# EAGLE design Main-board (EAGLE 9.6.2)
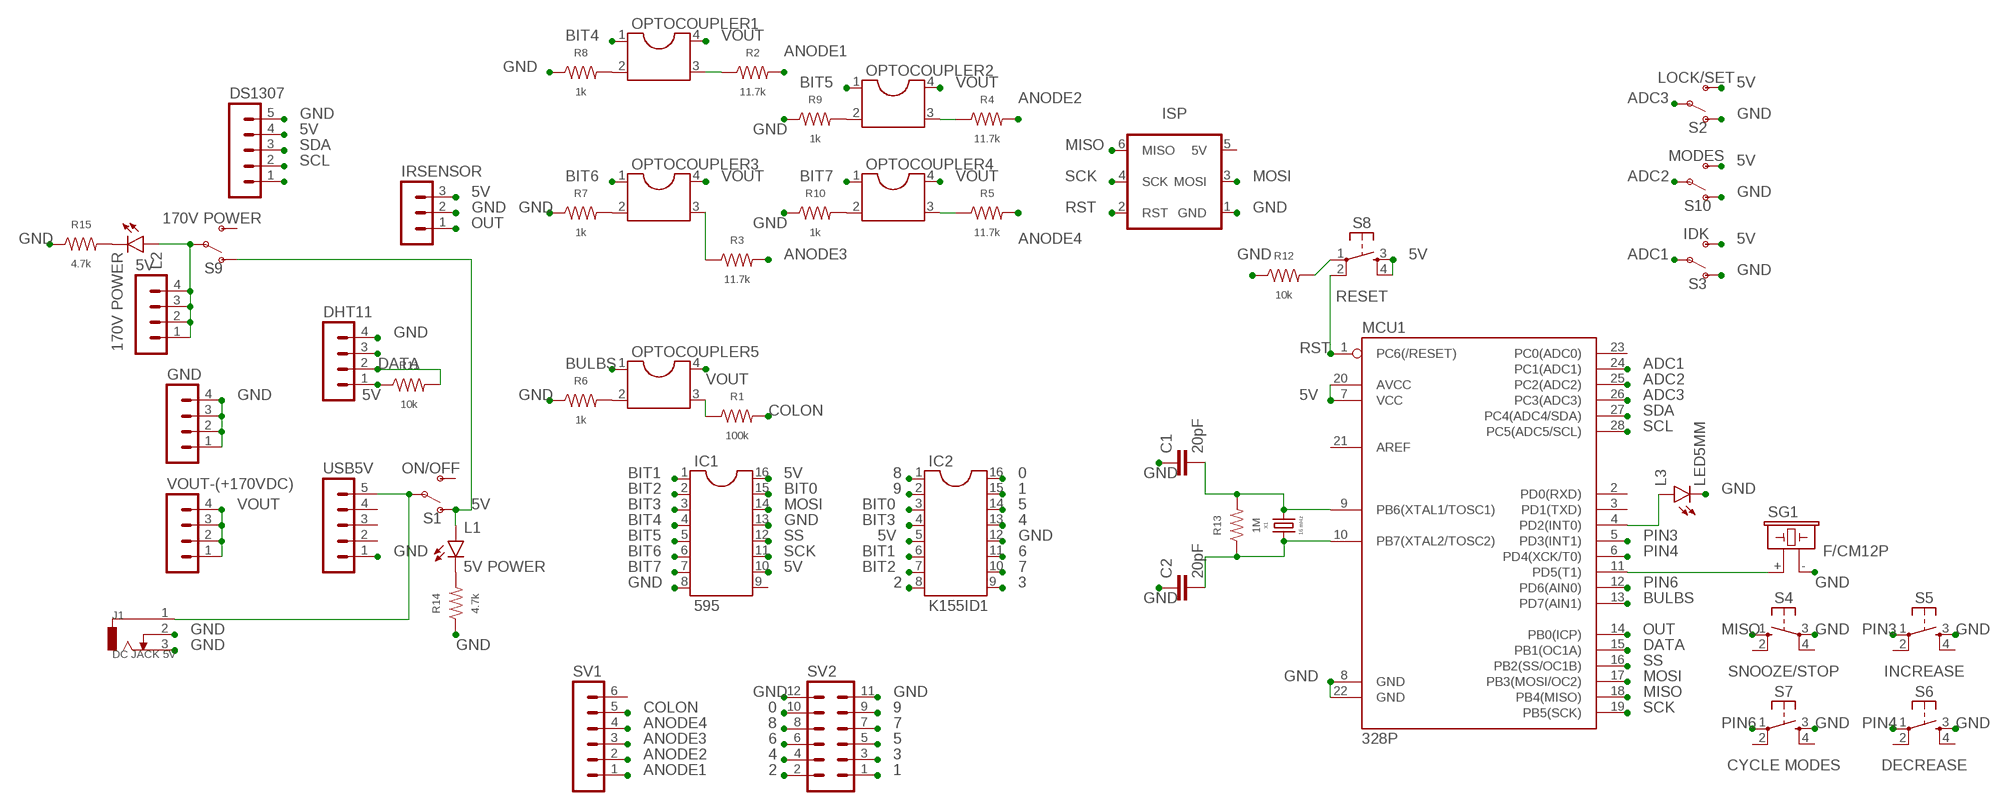
[diagram p0: schematic, sheet 1]

## Parts
5V  MA04-1  [MA04-1]
C1  20pF  CAP_DISK  [CAP-PTH-2.54]
C2  20pF  CAP_DISK  [CAP-PTH-2.54]
DHT11  MA04-1  [MA04-1]
DS1307  MA05-1  [MA05-1]
GND  MA04-1  [MA04-1]
H1  ISP_HEADER  [ICSP]
IC1  595  DIL16  [DIL16]
IC2  K155ID1  DIL16  [DIL16]
IRSENSOR  MA03-1  [MA03-1]
J1  DC JACK 5V  DC_JACK/PJ-202AH  [PJ-202AH]
L1  5V POWER  LED3MM  [LED3MM]
L2  170V POWER  LED3MM  [LED3MM]
L3  LED5MM  [LED5MM]
MCU1  328P  ATMEGA328P_PDIP  [DIP28]
OPTOCOUPLER1  DIL4  [DIL04]
OPTOCOUPLER2  DIL4  [DIL04]
OPTOCOUPLER3  DIL4  [DIL04]
OPTOCOUPLER4  DIL4  [DIL04]
OPTOCOUPLER5  DIL4  [DIL04]
R1  100k  RESISTOR  [0207/10]
R2  11.7k  RESISTOR  [0207/10]
R3  11.7k  RESISTOR  [0207/10]
R4  11.7k  RESISTOR  [0207/10]
R5  11.7k  RESISTOR  [0207/10]
R6  1k  RESISTOR  [0207/10]
R7  1k  RESISTOR  [0207/10]
R8  1k  RESISTOR  [0207/10]
R9  1k  RESISTOR  [0207/10]
R10  1k  RESISTOR  [0207/10]
R11  10k  RESISTOR  [0207/10]
R12  10k  RESISTOR  [0207/10]
R13  1M  RESISTOR  [0207/10]
R14  4.7k  RESISTOR  [0207/10]
R15  4.7k  RESISTOR  [0207/10]
S1  ON/OFF  SLIDE_SWITCHEG1218  [EG1218]
S2  LOCK/SET  SLIDE_SWITCHEG1218  [EG1218]
S3  IDK  SLIDE_SWITCHEG1218  [EG1218]
S4  SNOOZE/STOP  MOMENTARY_BUTTONS-ROUND  [B3F-40XX-ROUND]
S5  INCREASE  MOMENTARY_BUTTONS6MMSMALL  [TACTILE_SWITCH_PTH_6.0MM]
S6  DECREASE  MOMENTARY_BUTTONS6MMSMALL  [TACTILE_SWITCH_PTH_6.0MM]
S7  CYCLE MODES  MOMENTARY_BUTTONS6MMSMALL  [TACTILE_SWITCH_PTH_6.0MM]
S8  RESET  MOMENTARY_BUTTONS6MMSMALL  [TACTILE_SWITCH_PTH_6.0MM]
S9  170V POWER  SLIDE_SWITCHEG1218  [EG1218]
S10  MODES  SLIDE_SWITCHEG1218  [EG1218]
SG1  F/CM12P  [F/CM12P]
SV1  MA06-1  [MA06-1]
SV2  MA06-2  [MA06-2]
USB5V  MA05-1  [MA05-1]
VOUT-(+170VDC)  MA04-1  [MA04-1]
X1  16 mHz  CRYSTAL_16MHZ  [HC49US]

## Nets
0: IC2.16 SV2.10
1: IC2.15 SV2.1
2: IC2.8 SV2.2
3: IC2.9 SV2.3
4: IC2.13 SV2.4
5: IC2.14 SV2.5
5V: DHT11.1 DS1307.4 IC1.10 IC1.16 IC2.5 IRSENSOR.3 L1.A MCU1.7(VCC) MCU1.20(AVCC) R11.1 S1.O S2.S S3.S S8.3(S) S8.4(S1) S9.O S10.S
6: IC2.11 SV2.6
7: IC2.10 SV2.7
8: IC2.1 SV2.8
9: IC2.2 SV2.9
ADC1: MCU1.24(PC1(ADC1)) S3.P
ADC2: MCU1.25(PC2(ADC2)) S10.P
ADC3: MCU1.26(PC3(ADC3)) S2.P
ANODE1: R2.2 SV1.1
ANODE2: R4.2 SV1.2
ANODE3: R3.2 SV1.3
ANODE4: R5.2 SV1.4
BIT0: IC1.15 IC2.3
BIT1: IC1.1 IC2.6
BIT2: IC1.2 IC2.7
BIT3: IC1.3 IC2.4
BIT4: IC1.4 OPTOCOUPLER1.1
BIT5: IC1.5 OPTOCOUPLER2.1
BIT6: IC1.6 OPTOCOUPLER3.1
BIT7: IC1.7 OPTOCOUPLER4.1
BULBS: MCU1.13(PD7(AIN1)) OPTOCOUPLER5.1
COLON: R1.2 SV1.5
DATA: DHT11.2 MCU1.15(PB1(OC1A)) R11.2
GND: C1.1 C2.1 DHT11.4 DS1307.5 GND.1 GND.2 GND.3 GND.4 H1.1(GND) IC1.8 IC1.13 IC2.12 IRSENSOR.2 J1.2 J1.3 L3.K(C) MCU1.8(GND) MCU1.22(GND) R6.1 R7.1 R8.1 R9.1 R10.1 R12.1 R14.1 R15.1 S2.O S3.O S4.3(P) S5.3(S) S6.3(S) S7.3(S) S10.O SG1.- SV2.11 SV2.12 USB5V.1
MISO: H1.6(MISO) MCU1.18(PB4(MISO)) S4.1(S)
MOSI: H1.3(MOSI) IC1.14 MCU1.17(PB3(MOSI/OC2))
N$1: OPTOCOUPLER3.3 R3.1
N$2: L1.K(C) R14.2
N$3: OPTOCOUPLER1.3 R2.1
N$4: OPTOCOUPLER2.3 R4.1
N$5: OPTOCOUPLER5.2 R6.2
N$6: OPTOCOUPLER3.2 R7.2
N$7: OPTOCOUPLER1.2 R8.2
N$8: OPTOCOUPLER2.2 R9.2
N$9: OPTOCOUPLER4.2 R10.2
N$10: OPTOCOUPLER4.3 R5.1
N$11: L2.K(C) R15.2
N$12: R12.2 S8.1(P)
N$13: OPTOCOUPLER5.3 R1.1
N$14: C1.2 MCU1.9(PB6(XTAL1/TOSC1)) R13.2 X1.2
N$15: C2.2 MCU1.10(PB7(XTAL2/TOSC2)) R13.1 X1.1
N$18: DHT11.3
N$22: 5V.1 5V.2 5V.3 5V.4 L2.A S9.P
N$25: J1.1 S1.P USB5V.5
N$26: L3.A MCU1.4(PD2(INT0))
N$32: DS1307.1
N$33: MCU1.11(PD5(T1)) SG1.+
OUT: IRSENSOR.1 MCU1.14(PB0(ICP))
PIN3: MCU1.5(PD3(INT1)) S5.1(P)
PIN4: MCU1.6(PD4(XCK/T0)) S6.1(P)
PIN6: MCU1.12(PD6(AIN0)) S7.1(P)
RST: H1.2(RST) MCU1.1(PC6(/RESET)) S8.2(P1)
SCK: H1.4(SCK) IC1.11 MCU1.19(PB5(SCK))
SCL: DS1307.2 MCU1.28(PC5(ADC5/SCL))
SDA: DS1307.3 MCU1.27(PC4(ADC4/SDA))
SS: IC1.12 MCU1.16(PB2(SS/OC1B))
VOUT: OPTOCOUPLER1.4 OPTOCOUPLER2.4 OPTOCOUPLER3.4 OPTOCOUPLER4.4 OPTOCOUPLER5.4 VOUT-(+170VDC).1 VOUT-(+170VDC).2 VOUT-(+170VDC).3 VOUT-(+170VDC).4
Unconnected: IC1.9 MCU1.2(PD0(RXD)) MCU1.3(PD1(TXD)) MCU1.21(AREF) MCU1.23(PC0(ADC0)) S1.S S4.2(S1) S4.4(P1) S5.2(P1) S5.4(S1) S6.2(P1) S6.4(S1) S7.2(P1) S7.4(S1) S9.S SV1.6 USB5V.2 USB5V.3 USB5V.4

## Power pins joined to a net without a drawn wire
5V: H1.5(5V)

## Library data of the parts
5V DHT11 GND VOUT-(+170VDC) = con-lstb:MA04-1: PIN HEADER; OC_FARNELL: unknown; OC_NEWARK: unknown
C1 C2 = ACES_THT:CAP_DISK: Use for 0.1μF (103) and 0.01μF (104). Also suitable for 22ρF crystal filter caps for offboard ATmega328p.
DS1307 USB5V = con-lstb:MA05-1: PIN HEADER; OC_FARNELL: unknown; OC_NEWARK: unknown
H1 = ACES_THT:ISP_HEADER: No more excuses for getting these lines crossed!
IC1 IC2 = ic-package:DIL16: Dual In Line / Socket
IRSENSOR = con-lstb:MA03-1: PIN HEADER; OC_FARNELL: unknown; OC_NEWARK: unknown
J1 = ACES_THT:DC_JACK: Through hole pins are either tapered pins (PJ-102A) or eyelet (straight or kinked) PJ-202AH.
L1-L3 = ACES_THT:LED
MCU1 = ACES_THT:ATMEGA328P_PDIP: Atmel 328P Through hole ATMEGA328P uC used in the Arduino: 32kb flash, 1k EEPROM, 2k SRAM Datasheet <http://www.sparkfun.com/datasheets/Components/SMD/ATMega328.pdf> Use together with either the CRYSTAL_16MHz or RESONATOR in this library.; PROD_ID: IC-09136
OPTOCOUPLER1-OPTOCOUPLER5 = ic-package:DIL4: Dual In Line / Socket
R1-R15 = ACES_THT:RESISTOR: Based on rcl Libray part R-US_0207/10 with longer oval pads for easier hand soldering. Digikey Part #: 470QBK-ND <https://www.digikey.ca/products/en/resistors/through-hole-resistors/53?k=fixed+resistor&k=&pkeyword=fixed+resistor&sv=1&pv2=4&pv174=18&sf=0&FV=ffe00035%2Cfffc000d%2C1c0003%2C1f140000%2Cmu470+Ohms%7C2085&quantity=&ColumnSort=0&page=1&stock=1&pageSize=25>
S1-S3 S9 S10 = ACES_THT:SLIDE_SWITCH
S4-S8 = ACES_THT:MOMENTARY_BUTTONS: OMRON SWITCH
SG1 = buzzer:F/CM12P: BUZZER Source: Buerklin; OC_FARNELL: unknown; OC_NEWARK: unknown
SV1 = con-lstb:MA06-1: PIN HEADER; OC_FARNELL: unknown; OC_NEWARK: unknown
SV2 = con-lstb:MA06-2: PIN HEADER; OC_FARNELL: unknown; OC_NEWARK: unknown
X1 = ACES_THT:CRYSTAL_16MHZ

## Board
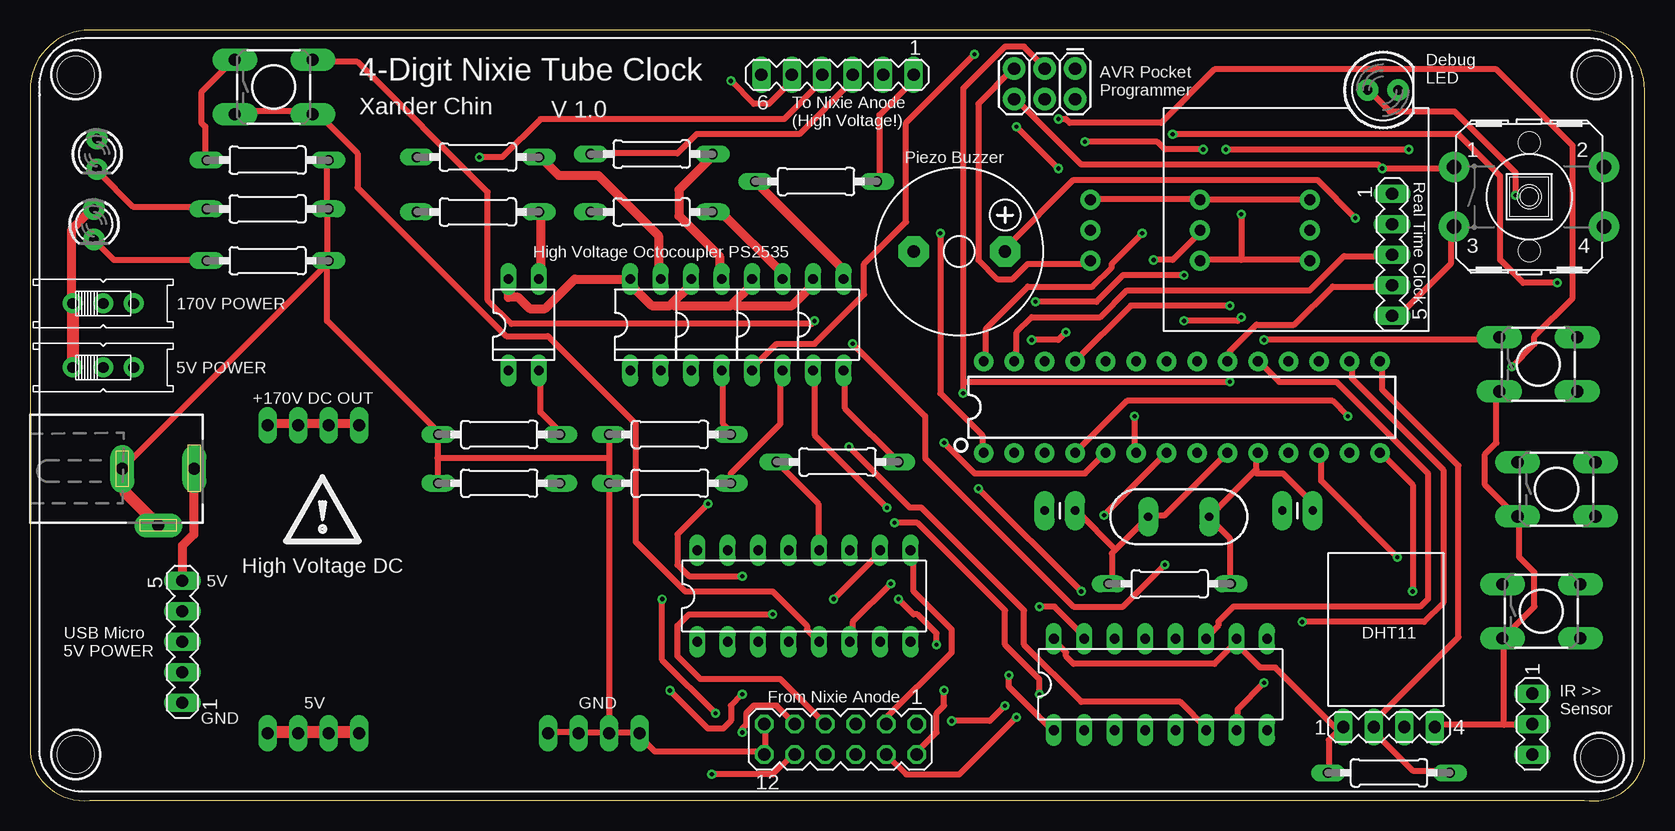
[diagram p1: board, top side]
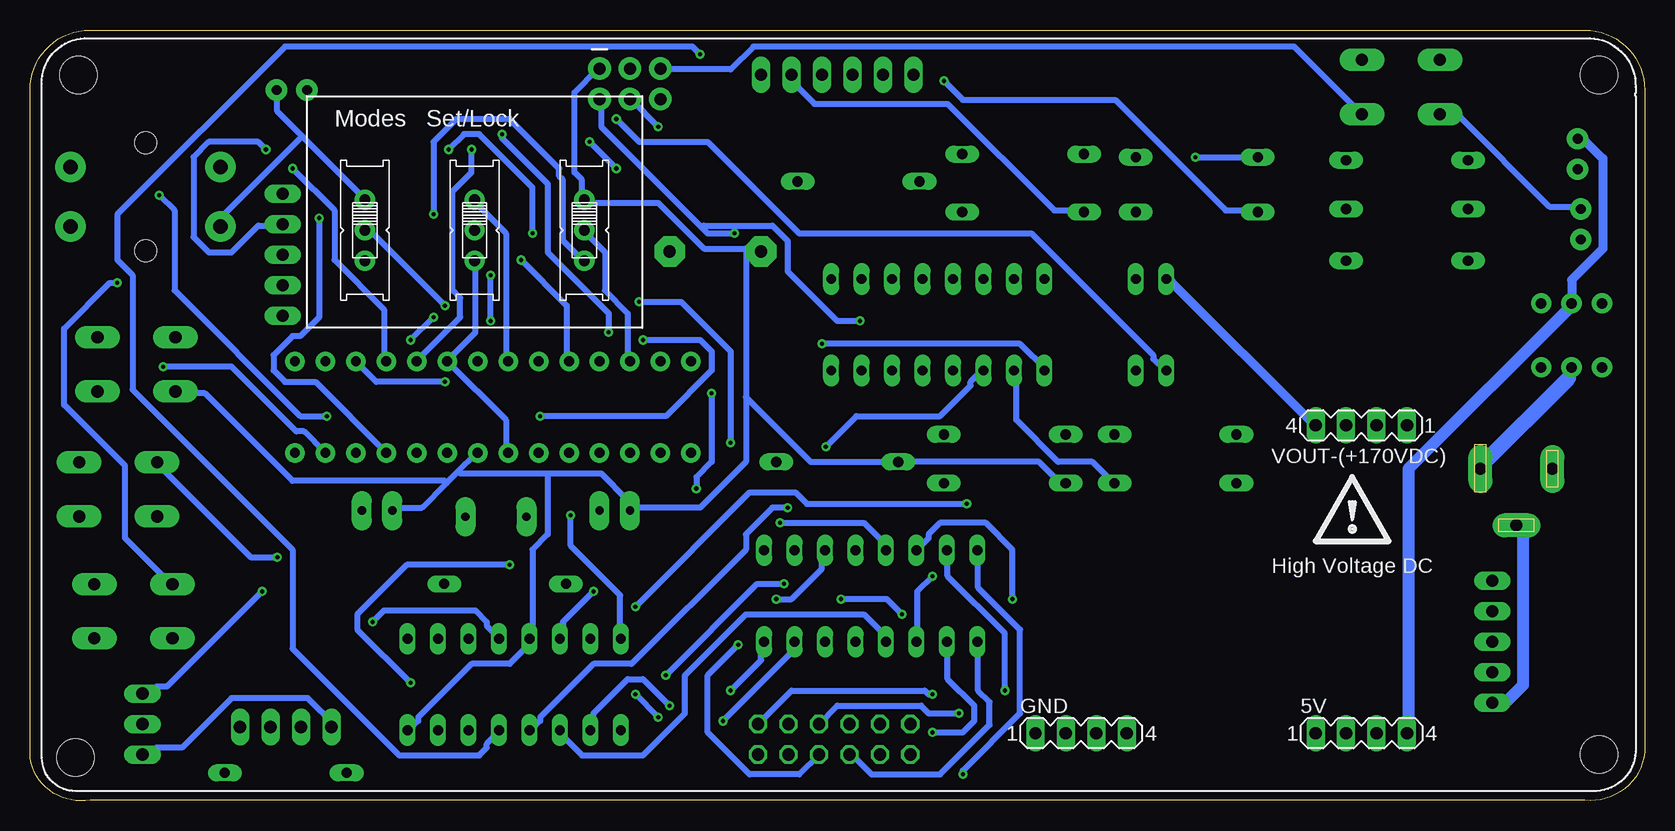
[diagram p2: board, bottom side, seen from below]

Size 134.6 x 64.24 mm. Coordinates in mm from the lower left corner, seen from the top.
Outline: 134.6,3.55 134.6,59.24 arc90 129.6,64.24 5,64.24 arc90 0,59.24 0,4.04 arc90 4.98,0.06 129.58,0.07 arc90 134.6,3.55
Copper layers (1*16): Top 0.035mm / dielectric 1.5mm / Bottom 0.035mm
Design rules "ACES_THT *": minimum track width 20mil, minimum drill 0.35mm, track to track 20mil, track to pad 20mil, pad to pad 20mil, via to via 20mil, smd to smd 6mil, copper to edge 40mil, drill to drill 6mil, minimum pad ring 10mil, minimum via ring 8mil, stop-mask expansion 4mil, vias tented up to drill 0mil, thermal gap 10mil

### Footprints (pad centres in the part's own frame; a part is rotated, then mirrored left to right if it is on the bottom)
MA04-1 = drill 1.016 long: 1 -3.81,0; 2 -1.27,0; 3 1.27,0; 4 3.81,0
CAP-PTH-2.54 = drill 0.7 pad 1.651 long: 1 -1.27,0; 2 1.27,0
MA05-1 = drill 1.016 long: 1 -5.08,0; 2 -2.54,0; 3 0,0; 4 2.54,0; 5 5.08,0
ICSP = drill 1.016 pad 1.88: 1 0,0; 2 0,2.54; 3 2.54,0; 4 2.54,2.54; 5 5.08,0; 6 5.08,2.54
DIL16 = drill 0.813 long: 1 -8.89,-3.81; 2 -6.35,-3.81; 3 -3.81,-3.81; 4 -1.27,-3.81; 5 1.27,-3.81; 6 3.81,-3.81; 7 6.35,-3.81; 8 8.89,-3.81; 9 8.89,3.81; 10 6.35,3.81; 11 3.81,3.81; 12 1.27,3.81; 13 -1.27,3.81; 14 -3.81,3.81; 15 -6.35,3.81; 16 -8.89,3.81
MA03-1 = drill 1.016 long: 1 -2.54,0; 2 0,0; 3 2.54,0
PJ-202AH = drill 1 pad 2 long: 1 13.7,4.5; 2 10.7,-0.2; 3 7.7,4.5
LED3MM = drill 0.813 pad 1.778: A 0,1.27; K 0,-1.27
LED5MM = drill 0.813 pad 1.778: A 0,1.27; K 0,-1.27
DIP28 = drill 0.813 pad 1.626: 1 -16.51,-3.81; 2 -13.97,-3.81; 3 -11.43,-3.81; 4 -8.89,-3.81; 5 -6.35,-3.81; 6 -3.81,-3.81; 7 -1.27,-3.81; 8 1.27,-3.81; 9 3.81,-3.81; 10 6.35,-3.81; 11 8.89,-3.81; 12 11.43,-3.81; 13 13.97,-3.81; 14 16.51,-3.81; 15 16.51,3.81; 16 13.97,3.81; 17 11.43,3.81; 18 8.89,3.81; 19 6.35,3.81; 20 3.81,3.81; 21 1.27,3.81; 22 -1.27,3.81; 23 -3.81,3.81; 24 -6.35,3.81; 25 -8.89,3.81; 26 -11.43,3.81; 27 -13.97,3.81; 28 -16.51,3.81
DIL04 = drill 0.813 long: 1 -1.27,-3.81; 2 1.27,-3.81; 3 1.27,3.81; 4 -1.27,3.81
0207/10 = drill 0.85 pad 1.422 long: 1 -5.08,0; 2 5.08,0
EG1218 = drill 0.9 pad 1.676: O -2.54,0; P 0,0; S 2.54,0
B3F-40XX-ROUND = drill 1.194 pad 2.54: 1 -6.248,2.489; 2 6.248,2.489; 3 -6.248,-2.489; 4 6.248,-2.489 | hole 1.803: 0,-4.496; 0,4.496
TACTILE_SWITCH_PTH_6.0MM = drill 1.016 pad 1.88 long: 1 -3.251,2.261; 2 3.251,2.261; 3 -3.251,-2.261; 4 3.251,-2.261
F/CM12P = drill 1.016 pad 2.54 octagon: + 3.81,0; - -3.81,0
MA06-1 = drill 1.016 long: 1 -6.35,0; 2 -3.81,0; 3 -1.27,0; 4 1.27,0; 5 3.81,0; 6 6.35,0
MA06-2 = drill 1.016 octagon: 1 -6.35,-1.27; 2 -6.35,1.27; 3 -3.81,-1.27; 4 -3.81,1.27; 5 -1.27,-1.27; 6 -1.27,1.27; 7 1.27,-1.27; 8 1.27,1.27; 9 3.81,-1.27; 10 3.81,1.27; 11 6.35,-1.27; 12 6.35,1.27
MOUNTINGHOLE_3.2MM_PLATEDTHIN = hole 3.1: 0,0
HC49US = drill 0.7 pad 1.651 long: 1 -2.54,0; 2 2.54,0

### Placement (x,y rotation side)
5V  23.62,5.64 0 bottom
C1  85.85,24.19 0 top
C2  105.66,24.19 0 top
DHT11  113.28,6.15 0 top
DS1307  113.54,45.52 270 top
GND  46.99,5.64 0 bottom
H1  87.12,61.02 180 top
IC1  94.23,9.71 0 top
IC2  64.52,17.07 0 top
IRSENSOR  125.22,6.41 270 top
J1  0,23.17 0 top
L1  5.33,48.06 0 top
L2  5.59,53.9 0 top
L3  112.78,59.24 90 top
MCU1  96.01,32.82 0 top
OPTOCOUPLER1  66.55,39.68 0 top
OPTOCOUPLER2  61.47,39.68 0 top
OPTOCOUPLER3  56.39,39.68 0 top
OPTOCOUPLER4  51.31,39.68 0 top
OPTOCOUPLER5  41.15,39.68 0 top
R1  37.34,49.08 180 top
R2  65.53,51.62 0 top
R3  51.82,53.9 180 top
R4  51.82,49.08 180 top
R5  37.34,53.65 180 top
R6  39.12,30.54 0 top
R7  53.34,30.54 0 top
R8  67.31,28.25 0 top
R9  53.34,26.47 0 top
R10  39.12,26.47 0 top
R11  113.28,2.34 0 top
R12  19.81,53.4 180 top
R13  95,18.09 180 top
R14  19.81,45.01 180 top
R15  19.81,49.33 180 top
S1  6.1,36.12 0 top
S2  88.39,47.55 270 bottom
S3  97.54,47.55 270 bottom
S4  124.97,50.35 0 top
S5  125.73,36.38 0 top
S6  125.98,15.8 0 top
S7  127.25,25.96 0 top
S8  20.32,59.49 0 top
S9  6.1,41.46 0 top
S10  106.68,47.55 270 bottom
SG1  77.47,45.78 0 top
SV1  67.31,60.51 180 top
SV2  67.56,5.14 180 top
U$1  [MOUNTINGHOLE_3.2MM_PLATEDTHIN]  3.81,60.51 0 top
U$2  [MOUNTINGHOLE_3.2MM_PLATEDTHIN]  3.81,3.87 0 top
U$3  [MOUNTINGHOLE_3.2MM_PLATEDTHIN]  130.81,3.61 0 top
U$4  [MOUNTINGHOLE_3.2MM_PLATEDTHIN]  130.56,60.51 0 top
U$5  [CAUTION-HIGH-VOLTAGE]  21.84,21.9 0 top
U$6  [CAUTION-HIGH-VOLTAGE]  26.92,21.9 0 bottom
USB5V  12.7,13.26 90 top
VOUT-(+170VDC)  23.62,31.3 180 bottom
X1  95.76,23.68 180 top

### Tracks (layer width: path | path; a pad name or v marks a point on that pad's centre or on a via)
0  (via drill 0.35)
  Top 0.508: v56.83,2.21 61.91,2.21 63.5,3.8 SV2.10
  Bottom 0.508: v56.83,2.21 56.83,2.53 52.07,7.29 52.07,14.28 55.56,17.77 55.56,20.63 IC2.16
1  (via drill 0.35)
  Top 0.508: v53.34,9.2 56.52,6.02 57.78,6.02 58.42,6.66 58.42,7.93 v59.37,8.88
  Bottom 0.508: v53.34,9.2 53.34,13.96 58.1,18.72 58.1,20.63 IC2.15 | v59.37,8.88 59.69,8.88 60.01,9.2 71.12,9.2 SV2.1
2  (via drill 0.35)
  Top 0.508: v76.2,9.2 76.2,7.93 75.56,7.29 75.56,5.71 73.98,4.12 SV2.2
  Bottom 0.508: v76.2,9.2 73.66,11.74 73.66,13.01 IC2.8
3
  Top 0.508: IC2.9 73.66,20.63 73.66,17.45 76.83,14.28 76.83,12.37 71.12,6.66 SV2.3
4  (via drill 0.35)
  Top 0.508: v72.07,23.17 73.98,23.17 81.28,15.87 81.28,13.01 84.14,10.15 v84.14,8.88 | v82.23,6.98 77.47,2.21 73.03,2.21 SV2.4
  Bottom 0.508: v72.07,23.17 65.09,23.17 63.5,21.58 63.5,20.95 IC2.13 | v82.23,6.98 v84.14,8.88
5  (via drill 0.35)
  Top 0.508: v52.7,16.82 52.7,11.74 v57.15,7.29
  Bottom 0.508: IC2.14 59.69,21.9 59.69,22.22 58.74,23.17 54.93,23.17 52.7,20.95 v52.7,16.82 | v57.15,7.29 59.69,7.29 60.33,7.93 67.31,7.93 SV2.5
5V  (via drill 0.35)
  Top 0.508: 100.97,45.08 106.68,45.08 S10.S | 100.97,45.08 97.79,45.08 S3.S | DS1307.4 113.35,42.85 108.58,42.85 105.41,39.68 102.23,39.68 100.01,37.46 100.01,36.82 MCU1.20 | IC1.16 85.41,13.33 86.36,12.37 86.36,12.06 87,11.42 98.74,11.42 100.65,13.33 IC1.10 100.65,13.01 102.55,11.1 103.82,11.1 108.9,6.02 DHT11.1 109.22,6.02 108.27,5.07 108.27,2.53 R11.1 | v89.53,23.8 MCU1.7 | S2.S 88.27,44.76 83.19,44.76 81.92,43.49 80.64,43.49 79.06,45.08 79.06,58.09 81.92,60.95 H1.5 | 5.08,49.2 L1.A | IC2.5 64.77,14.28 64.77,14.6 61.91,17.45 54.61,17.45 50.48,21.58 50.48,31.42 43.18,38.73 39.69,38.73 27.3,51.11 27.3,53.97 23.81,57.46 S8.4 23.5,57.46 17.14,57.46 S8.3 | v100.97,48.89 100.97,45.08
  Top 0.762: 5.08,49.2 3.49,47.62 3.49,41.9 3.56,41.84 S9.O
  Top 1.016: S9.O S1.O
  Bottom 0.508: MCU1.7 94.93,29.2 94.93,31.74 MCU1.20 99.69,36.82 97.47,39.04 97.47,44.76 S3.S | IRSENSOR.3 124.08,4.44 121.92,4.44 117.79,8.56 111.44,8.56 109.22,6.34 DHT11.1 | v89.53,23.8 89.53,21.26 85.41,17.14 85.41,13.64 IC1.16 | L1.A 5.4,49.52 7.94,49.52 15.56,57.14 16.83,57.14 S8.3 | H1.5 81.92,60.95 76.2,60.95 74.3,62.86 29.21,62.86 23.81,57.46 S8.4 | v100.97,48.89 100.97,54.92 99.06,56.82 94.61,56.82 90.49,52.7 90.49,52.06 90.17,51.74 90.17,46.66 88.58,45.08 S2.S
6  (via drill 0.35)
  Top 0.508: v72.39,16.82 73.66,15.55 73.98,15.55 75.56,13.96 v75.56,13.01
  Bottom 0.508: v72.39,16.82 71.12,16.82 68.58,19.36 68.58,20.63 IC2.11 | v75.56,13.01 78.11,10.47 78.11,5.71 74.61,2.21 70.48,2.21 SV2.6
7  (via drill 0.35)
  Top 0.508: v66.99,16.82 70.8,20.63 IC2.10 | v61.91,15.55 54.93,15.55 53.98,14.6 53.98,12.06 55.88,10.15 62.55,10.15 SV2.7
  Bottom 0.508: v66.99,16.82 63.18,16.82 v61.91,15.55
8
  Bottom 0.508: IC2.1 55.56,13.01 55.56,9.2 54.61,8.25 54.61,6.34 58.74,2.21 64.45,2.21 66.04,3.8 SV2.8
9  (via drill 0.35)
  Top 0.508: v59.37,5.71 59.37,6.02 59.69,6.34 59.69,7.29 60.33,7.93 62.23,7.93 SV2.9
  Bottom 0.508: v59.37,5.71 56.83,5.71 55.88,6.66 55.88,7.93 58.1,10.15 58.1,13.01 IC2.2
ADC1  (via drill 0.35)
  Top 0.508: v93.66,45.08 95.25,45.08 97.47,47.3 S3.P
  Bottom 0.508: v93.66,45.08 89.85,41.27 89.85,36.82 MCU1.24
ADC2  (via drill 0.35)
  Top 0.508: MCU1.25 91.76,41.27 v100.01,41.27
  Bottom 0.508: v100.01,41.27 106.05,47.3 106.68,47.3 S10.P
ADC3
  Bottom 0.508: MCU1.26 84.77,36.82 84.77,40.63 86.68,42.54 86.68,45.71 88.27,47.3 S2.P
ANODE1
  Top 0.508: SV1.1 73.66,60 70.8,57.14 70.8,51.74 R2.2
ANODE2
  Bottom 0.508: SV1.2 71.12,60 69.22,58.09 58.1,58.09 49.21,49.2 46.99,49.2 R4.2
ANODE3
  Top 0.508: SV1.3 68.58,60 64.14,55.55 55.56,55.55 53.98,53.97 46.99,53.97 R3.2
ANODE4  (via drill 0.35)
  Top 0.508: v37.47,53.65 39.37,53.65 42.55,56.82 62.87,56.82 66.04,60 SV1.4
  Bottom 0.508: v37.47,53.65 R5.2
BIT0  (via drill 0.35)
  Top 0.508: v59.37,18.72 54.93,18.72 53.98,19.68 53.98,22.22 v56.52,24.76 | v84.14,16.18 85.41,16.18 87.95,13.64 IC1.15
  Bottom 0.508: v59.37,18.72 60.64,17.45 60.64,13.33 IC2.3 | v56.52,24.76 69.85,24.76 70.8,25.71 74.61,25.71 v84.14,16.18
BIT1  (via drill 0.35)
  Top 0.508: v71.75,18.09 68.58,14.91 68.58,13.33 IC2.6 | v81.6,10.47 81.6,9.52 85.09,6.02 IC1.1
  Bottom 0.508: v71.75,18.09 73.98,18.09 v81.6,10.47
BIT2  (via drill 0.35)
  Top 0.508: v76.83,6.66 80.01,6.66 v81.28,7.93
  Bottom 0.508: v76.83,6.66 71.12,12.37 71.12,13.01 IC2.7 | v81.28,7.93 83.5,10.15 84.77,10.15 87.63,7.29 87.63,6.02 IC1.2
BIT3
  Bottom 0.508: IC2.4 63.5,13.33 63.5,13.96 65.09,15.55 74.93,15.55 80.01,10.47 80.01,7.29 83.5,3.8 88.58,3.8 90.49,5.71 IC1.3
BIT4  (via drill 0.35)
  Top 0.508: v71.44,24.44 65.41,30.47 65.41,35.87 OPTOCOUPLER1.1
  Bottom 0.508: v71.44,24.44 72.71,24.44 74.93,22.22 74.93,20.95 84.45,11.42 87.63,11.42 92.08,6.98 92.08,6.66 92.71,6.02 IC1.4
BIT5  (via drill 0.35)
  Top 0.508: v78.74,62.22 73.03,56.51 73.03,48.25 69.53,44.76 69.53,42.22 65.41,38.09 62.23,38.09 60.01,35.87 OPTOCOUPLER2.1
  Bottom 0.508: v78.74,62.22 79.38,62.86 113.35,62.86 127.32,48.89 127.32,45.08 126.05,43.81 126.05,34.28 112.71,20.95 112.71,12.69 103.82,3.8 97.16,3.8 96.52,4.44 96.52,4.75 95.57,5.71 IC1.5
BIT6  (via drill 0.35)
  Top 0.508: v68.26,29.52 73.34,24.44 74.3,24.44 82.87,15.87 82.87,13.01 87.63,8.25 95.89,8.25 98.11,6.02 IC1.6
  Bottom 0.508: v68.26,29.52 65.72,32.06 58.74,32.06 56.2,34.6 56.2,34.92 55.24,35.87 OPTOCOUPLER3.1
BIT7  (via drill 0.35)
  Top 0.508: v102.87,9.83 100.65,7.61 100.65,6.02 IC1.7 | v94.61,19.68 91.12,16.18 87,16.18 74.61,28.57 74.61,32.06 v68.58,38.09
  Bottom 0.508: v102.87,9.83 107.31,14.28 107.31,15.55 103.19,19.68 v94.61,19.68 | v68.58,38.09 52.07,38.09 49.85,35.87 OPTOCOUPLER4.1
BULBS  (via drill 0.35)
  Top 0.508: v85.72,56.82 86.36,56.82 86.68,56.51 94.3,56.51 98.74,60.95 122.24,60.95 128.59,54.6 128.59,41.9 125.41,38.73 125.41,38.09 v123.51,36.19
  Bottom 0.508: v85.72,56.82 83.82,54.92 78.11,54.92 70.48,47.3 51.12,47.3 40.96,37.14 40.96,36.82 40.01,35.87 OPTOCOUPLER5.1 | v123.51,36.19 117.79,36.19 112.39,30.79 111.76,30.79 MCU1.13
COLON  (via drill 0.35)
  Top 0.508: v58.42,60 60.33,58.09 61.59,58.09 63.5,60 SV1.5
  Bottom 0.508: v58.42,60 56.83,58.41 44.13,58.41 34.92,49.2 32.38,49.2 R1.2
DATA
  Top 0.508: R11.2 118.11,2.53 115.25,2.53 111.76,6.02 DHT11.2 111.76,6.34 119.06,13.64 119.06,27.93 112.71,34.28 112.71,36.5 MCU1.15
GND
  Top 0.508: 7.94,27.61 J1.3 7.94,27.93 24.77,44.76 | 10.48,23.17 J1.2 | SV2.11 61.28,6.34 61.28,4.12 SV2.12 60.96,4.12 52.07,4.12 50.8,5.39 GND.1 50.8,5.71 48.26,5.71 | 45.72,5.71 43.18,5.71 GND.4 | 45.72,5.71 48.26,5.71 | 45.72,5.71 GND.3 | R8.1 65.72,24.76 65.72,20.95 IC2.12 | R12.1 24.77,53.33 24.77,49.52 R15.1 24.77,49.2 24.77,45.08 R14.1 24.93,44.93 24.77,44.76 | 33.97,28.57 33.97,30.47 R6.1 33.97,30.79 24.77,40 24.77,44.76 | 33.97,28.57 33.97,26.66 R10.1 | R7.1 48.26,28.57 | 48.26,28.57 R9.1 48.26,5.71 | 48.26,28.57 33.97,28.57 | 48.26,5.71 GND.2 | 122.87,6.34 124.78,6.34 124.9,6.41 IRSENSOR.2 | 122.87,6.34 117.16,6.34 DHT11.4 | 122.87,6.34 122.87,13.33 S6.3 122.87,13.64 125.41,16.18 125.41,19.04 124.14,20.31 124.14,23.49 S7.3 123.83,23.8 121.28,26.34 121.28,28.88 122.24,29.84 122.24,33.96 S5.3 | DS1307.5 113.67,40.63 114.3,40.63 118.43,44.76 118.43,47.62 S4.3 | S2.O 88.58,50.16 97.47,50.16 S3.O 97.79,50.16 106.68,50.16 S10.O
  Top 0.762: 7.94,25.71 7.94,27.61
  Top 1.016: 10.48,23.17 7.94,25.71
  Bottom 0.508: 10.16,22.53 10.48,22.85 J1.2 | 12.7,8.25 USB5V.1 | R9.1 48.26,26.66 48.9,26.66 50.48,28.25 R8.1 69.53,28.25 74.93,33.65 | IC1.8 102.87,6.02 102.23,6.66 102.23,6.98 97.79,11.42 94.61,11.42 92.71,13.33 IC1.13 92.71,13.64 92.71,20.95 91.44,22.22 91.44,27.3 | 99.85,26.5 101.92,24.44 104.14,24.44 C2.1 | 99.85,26.5 98.9,27.46 | 98.9,27.46 97.47,28.88 MCU1.8 | 91.44,27.3 98.74,27.3 98.9,27.46 | 91.44,27.3 87,27.3 84.77,25.07 84.77,24.44 C1.1 84.45,24.44 78.74,24.44 74.93,28.25 74.93,33.65 | S5.3 122.24,33.96 120.02,33.96 112.71,26.66 100.01,26.66 99.85,26.5 | MCU1.22 94.93,36.82 94.93,47.3 97.47,49.84 S3.O | 111.92,55.4 106.68,50.16 S10.O | 111.92,55.4 113.98,57.46 113.98,59.05 L3.K | H1.1 87.31,60.95 89.22,59.05 89.22,52.38 88.58,51.74 88.58,50.16 S2.O 88.27,49.84 82.23,49.84 78.42,46.03 74.93,46.03 | 74.93,46.03 73.66,46.03 SG1.- | 111.92,55.4 118.43,48.89 118.43,47.93 S4.3 | 74.93,46.03 74.93,33.65
  Bottom 1.016: 12.7,8.25 11.56,8.25 10.16,9.64 10.16,22.53
MISO  (via drill 0.35)
  Top 0.508: S4.1 118.43,52.7 v112.71,52.7 112.39,53.01 87.63,53.01 82.23,58.41 H1.6
  Bottom 0.508: v112.71,52.7 109.22,49.2 109.22,45.08 105.09,40.95 105.09,36.82 MCU1.18
MOSI  (via drill 0.35)
  Top 0.508: v79.06,26.03 v87.63,17.45 | 77.79,34.92 77.79,59.36 81.28,62.86 82.87,62.86 84.45,61.27 H1.3 | 77.79,34.92 v77.79,33.96 | 77.79,34.92 v100.01,34.92
  Bottom 0.508: v87.63,17.45 90.17,14.91 90.17,13.64 IC1.14 | v79.06,26.03 79.06,26.98 77.79,28.25 v77.79,33.96 | MCU1.17 105.73,34.92 v100.01,34.92
N$1
  Top 0.508: 57.47,43.49 OPTOCOUPLER3.3 | 56.83,53.65 R3.1
  Top 0.762: 57.47,43.49 57.47,45.39 54.1,48.76 54.1,50.92 56.83,53.65
N$2
  Top 0.508: R14.2 14.54,45.08 6.99,45.08 5.4,46.66 L1.K
N$3
  Top 0.508: 67.63,43.49 OPTOCOUPLER1.3
  Top 0.762: 67.63,43.49 67.63,44.44 R2.1
N$4
  Top 0.508: 62.55,43.49 OPTOCOUPLER2.3 | 57.15,48.89 R4.1
  Top 0.762: 62.55,43.49 62.55,44.12 57.78,48.89 57.15,48.89
N$5
  Top 0.508: OPTOCOUPLER5.2 42.55,35.87 42.55,32.38 44.13,30.79 R6.2
N$6
  Top 0.508: OPTOCOUPLER3.2 57.78,35.87 57.78,31.42 58.42,30.79 R7.2
N$7
  Top 0.508: R8.2 67.94,32.69 67.94,35.87 OPTOCOUPLER1.2
N$8
  Top 0.508: R9.2 58.42,27.3 62.55,31.42 62.55,35.87 OPTOCOUPLER2.2
N$9
  Bottom 0.508: OPTOCOUPLER4.2 52.39,35.87 52.39,31.74 48.9,28.25 46.04,28.25 44.45,26.66 R10.2
N$10
  Top 0.508: 52.39,43.49 OPTOCOUPLER4.3 | 42.55,53.65 R5.1
  Top 0.762: 52.39,43.49 52.39,47.11 47.37,52.13 44.07,52.13 42.55,53.65
N$11
  Top 0.508: R15.2 14.54,49.52 8.57,49.52 5.71,52.38 L2.K
N$12
  Top 0.508: R12.2 14.61,53.65 14.61,56.19 14.29,56.51 14.29,59.05 16.83,61.59 S8.1
N$13
  Top 0.508: 42.55,43.49 OPTOCOUPLER5.3 | 42.55,48.89 R1.1
  Top 0.762: 42.55,48.89 42.55,43.49
N$14
  Top 0.508: 90.49,20.95 X1.2 93.34,23.8 94.61,23.8 MCU1.9 | 90.49,20.95 90.17,20.63 90.17,18.09 R13.2 | 90.49,20.95 87.31,24.12 C1.2
N$15
  Top 0.508: R13.1 100.01,18.09 100.01,21.9 98.42,23.49 X1.1 102.08,27.46 | 102.08,27.46 102.23,27.61 102.23,28.88 MCU1.10 | C2.2 106.68,24.44 106.68,25.07 104.46,27.3 102.23,27.3 102.08,27.46
N$22
  Top 0.508: 20,5.71 5V.4 | 22.23,5.71 5V.3 22.54,5.71 | 25.08,5.71 5V.2 24.77,5.71 | 27.3,5.71 5V.1
  Top 1.016: 22.23,5.71 20,5.71 | 27.3,5.71 25.08,5.71 | 24.77,5.71 22.54,5.71
  Bottom 0.508: 19.68,5.71 5V.4
  Bottom 0.762: S9.P 6.1,43.43 3.49,46.03 3.49,53.52 5.14,55.17 L2.A
  Bottom 0.965: 19.68,27.68 6.1,41.27
  Bottom 1.016: 19.68,27.68 19.68,5.71
  Bottom 1.27: S9.P 6.1,41.27
N$25
  Top 0.508: 13.65,27.61 J1.1
  Top 0.762: USB5V.5 12.7,21.26 13.65,22.22 13.65,27.61
  Bottom 0.508: 6.35,35.23 6.35,35.87 | 13.65,27.93 J1.1
  Bottom 1.016: 6.35,35.87 S1.P
  Bottom 1.27: 13.65,27.93 6.35,35.23
N$26  (via drill 0.35)
  Top 0.508: MCU1.4 91.44,33.33 108.58,33.33 v109.86,32.06 | v123.83,50.47 123.83,52.38 118.75,57.46 113.35,57.46 111.76,59.05 L3.A
  Bottom 0.508: v109.86,32.06 112.08,32.06 122.56,42.54 122.56,49.2 v123.83,50.47
N$33  (via drill 0.35)
  Top 0.508: v110.49,48.57 107.31,51.74 87,51.74 81.28,46.03 SG1.+
  Bottom 0.508: MCU1.11 110.81,34.92 113.35,34.92 114.3,35.87 114.3,37.14 112.71,38.73 112.08,38.73 110.49,40.31 v110.49,48.57
OUT  (via drill 0.35)
  Top 0.508: v115.25,17.45 115.25,26.34 112.71,28.88 MCU1.14
  Bottom 0.508: v115.25,17.45 123.19,9.52 124.08,9.52 IRSENSOR.1
PIN3  (via drill 0.35)
  Top 0.508: MCU1.5 87.95,27.3 78.74,27.3 v76.2,29.84 | v83.82,41.58 88.9,41.58 91.12,43.81 v96.2,43.81 | v96.2,40 100.65,40 v100.97,40.31 | v102.87,38.41 122.24,38.41 S5.1
  Bottom 0.508: v76.2,29.84 76.2,37.46 80.33,41.58 v83.82,41.58 | v96.2,40 v96.2,43.81 | v102.87,38.41 v100.97,40.31
PIN4  (via drill 0.35)
  Top 0.508: v92.08,32.06 92.08,29.2 MCU1.6 | v83.5,38.41 85.72,38.41 v86.36,39.04 | v95.25,55.55 119.06,55.55 122.56,52.06 122.56,45.08 124.46,43.17 v127.32,43.17
  Bottom 0.508: v92.08,32.06 81.6,32.06 77.79,35.87 77.79,37.46 78.74,38.41 v83.5,38.41 | v86.36,39.04 86.36,40.63 91.44,45.71 91.44,51.43 95.25,55.24 v95.25,55.55 | v127.32,43.17 127.95,43.17 131.76,39.36 131.76,33.01 126.68,27.93 126.68,21.9 122.87,18.09 S6.1
PIN6  (via drill 0.35)
  Top 0.508: v113.98,20.31 107.63,26.66 107.63,28.88 MCU1.12
  Bottom 0.508: v113.98,20.31 116.2,20.31 123.83,27.93 S7.1
RST  (via drill 0.35)
  Top 0.508: v75.88,47.3 75.88,33.96 79.38,30.47 79.38,29.2 MCU1.1 | v65.41,40 65.15,39.74 40.13,39.74 38.16,41.71 38.16,50.73 27.3,61.59 23.81,61.59 S8.2
  Bottom 0.508: v75.88,47.3 78.11,47.3 78.58,47.78 | 78.58,47.78 87,56.19 87,58.41 H1.2 | v65.41,40 67.31,40 71.44,44.12 71.44,46.66 72.71,47.93 78.42,47.93 78.58,47.78
SCK  (via drill 0.35)
  Top 0.508: IC1.11 98.11,13.64 99.06,14.6 99.06,14.91 100.33,16.18 115.89,16.18 116.52,16.82 116.52,27.3 108.9,34.92 104.14,34.92 102.55,36.5 MCU1.19 | v85.72,52.7 v82.23,56.19 | v87.95,54.92 93.98,54.92 94.61,54.28 v97.79,54.28
  Bottom 0.508: v82.23,56.19 84.45,58.41 H1.4 | v87.95,54.92 v85.72,52.7 | v97.79,54.28 97.79,52.38 99.38,50.79 99.38,42.54 98.74,41.9 98.74,40.31 102.23,36.82 MCU1.19
SCL  (via drill 0.35)
  Top 0.508: v99.69,54.28 v114.94,54.28 | v92.71,47.3 90.17,44.76 90.17,44.44 88.58,42.85 83.19,42.85 79.69,39.36 79.69,36.82 MCU1.28
  Bottom 0.508: v114.94,54.28 115.57,54.92 119.7,54.92 120.97,53.65 120.97,46.98 119.7,45.71 117.79,45.71 115.57,47.93 113.67,47.93 DS1307.2 | v99.69,54.28 98.42,55.55 97.16,55.55 92.71,51.11 v92.71,47.3
SDA
  Top 0.508: DS1307.3 113.35,45.39 109.54,45.39 106.68,42.54 91.44,42.54 89.22,40.31 83.5,40.31 82.23,39.04 82.23,36.82 MCU1.27
SS  (via drill 0.35)
  Top 0.508: v106.05,14.91 116.2,14.91 117.79,16.5 117.79,27.61 110.17,35.23 110.17,36.5 MCU1.16
  Bottom 0.508: v106.05,14.91 105.09,15.87 97.47,15.87 96.52,14.91 96.52,14.6 95.57,13.64 IC1.12
VOUT
  Top 0.508: 20,31.42 VOUT-(+170VDC).1 | 22.23,31.42 VOUT-(+170VDC).2 22.54,31.42 | 53.34,41.27 53.5,41.43 53.66,41.27 | 54.93,43.49 OPTOCOUPLER3.4 | 49.85,43.49 OPTOCOUPLER4.4 | 58.42,41.27 58.58,41.43 58.74,41.27 | 65.09,43.49 OPTOCOUPLER1.4 | 25.08,31.42 VOUT-(+170VDC).3 24.77,31.42 | 27.3,31.42 VOUT-(+170VDC).4
  Top 0.762: 22.23,31.42 20,31.42 | 49.59,43.49 45.4,43.49 42.93,41.01 41.66,41.01 40.7,41.97 39.88,41.97 OPTOCOUPLER5.4 | 49.59,43.49 49.85,43.49 | 54.93,43.49 54.93,42.85 53.5,41.43 | 53.34,41.27 51.82,41.27 49.59,43.49 | 58.58,41.43 60.01,42.85 60.01,43.49 OPTOCOUPLER2.4 | 53.66,41.27 58.42,41.27 | 65.09,43.49 65.09,42.85 63.5,41.27 58.74,41.27 | 27.3,31.42 25.08,31.42 | 24.77,31.42 22.54,31.42
  Bottom 0.508: 39.43,43.24 39.62,43.24 OPTOCOUPLER5.4 | 27.62,31.42 VOUT-(+170VDC).4
  Bottom 0.762: 27.62,31.42 39.43,43.24

### Text on the board
_tsilk: 4-Digit Nixie Tube Clock | Debug / LED | AVR Pocket / Programmer | Xander Chin | V 1.0 | To Nixie Anode / (High Voltage!) | Piezo Buzzer | Real Time Clock | High Voltage Octocoupler PS2535 | 170V POWER | 5V POWER | +170V DC OUT | 5V | DHT11 | USB Micro / 5V POWER | 5V | GND | From Nixie Anode | GND | IR >> / Sensor
_bsilk: Set/Lock | Modes